# EAGLE design M783bad (EAGLE 6.6.0)
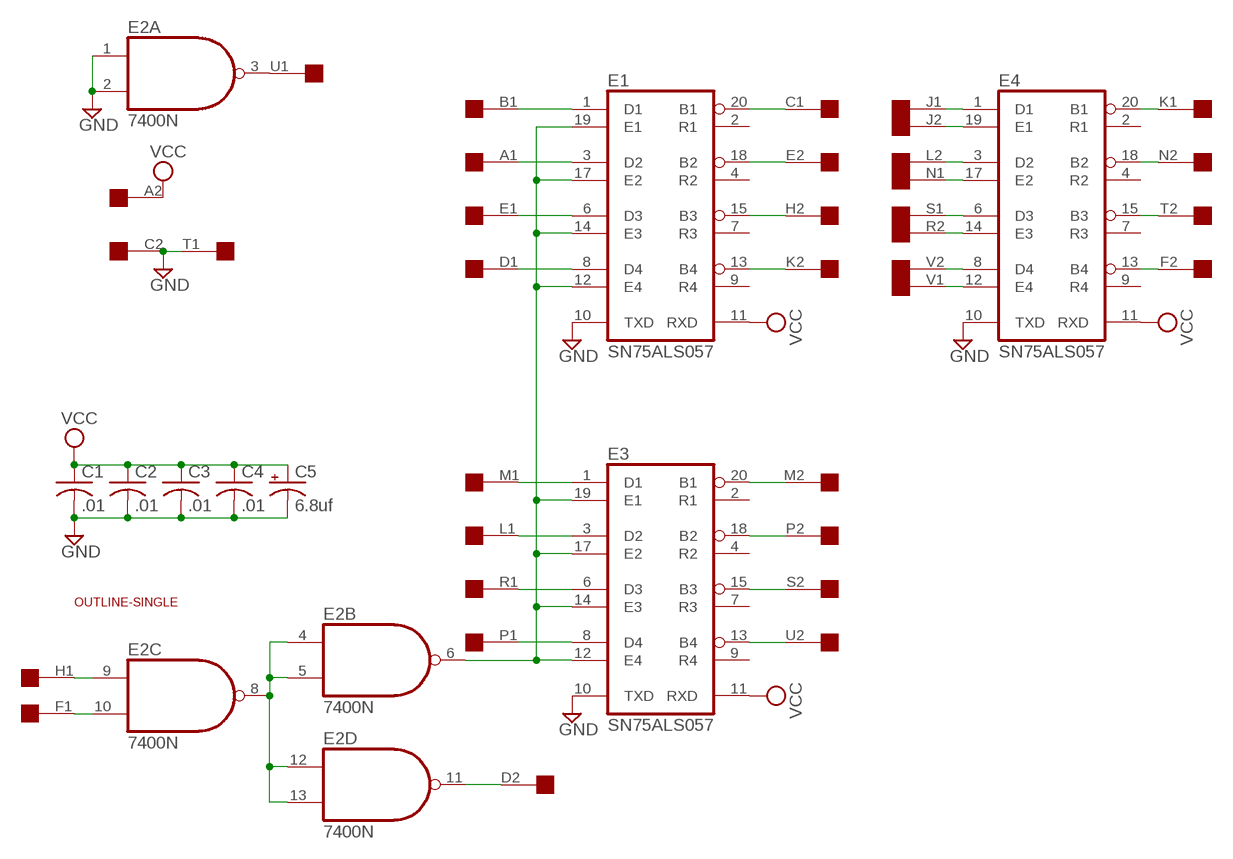
[diagram p0: schematic, sheet 1]

## Parts
C1  .01  C-US050-025X075  [C050-025X075]
C2  .01  C-US050-025X075  [C050-025X075]
C3  .01  C-US050-025X075  [C050-025X075]
C4  .01  C-US050-025X075  [C050-025X075]
C5  6.8uf  CPOL-USE15-5AXIAL  [E15-5]
E1  SN75ALS057  [DIL20]
E2  7400N  [DIL14]
E3  SN75ALS057  [DIL20]
E4  SN75ALS057  [DIL20]
U$1  SINGLE  [EDGE-CON2]
U$2  OUTLINE-SINGLE  [SINGLE]

## Nets
GND: C1.2 C2.2 C3.2 C4.2 C5.- E1.10(TXD) E2.1(A:I0) E2.2(A:I1) E3.10(TXD) E4.10(TXD) U$1.C2 U$1.T1
N$1: E2.3(A:O) U$1.U1
N$2: E1.12(E4) E1.14(E3) E1.17(E2) E1.19(E1) E2.6(B:O) E3.12(E4) E3.14(E3) E3.17(E2) E3.19(E1)
N$3: E3.20(B1) U$1.M2
N$4: E3.18(B2) U$1.P2
N$5: E3.8(D4) U$1.P1
N$6: E3.6(D3) U$1.R1
N$7: E3.15(B3) U$1.S2
N$8: E3.3(D2) U$1.L1
N$9: E3.13(B4) U$1.U2
N$10: E3.1(D1) U$1.M1
N$11: E1.20(B1) U$1.C1
N$12: E1.1(D1) U$1.B1
N$13: E1.18(B2) U$1.E2
N$14: E1.3(D2) U$1.A1
N$15: E1.15(B3) U$1.H2
N$16: E1.6(D3) U$1.E1
N$17: E1.13(B4) U$1.K2
N$18: E1.8(D4) U$1.D1
N$19: E2.11(D:O) U$1.D2
N$20: E4.13(B4) U$1.F2
N$21: E4.15(B3) U$1.T2
N$22: E4.18(B2) U$1.N2
N$23: E4.20(B1) U$1.K1
N$24: E4.1(D1) U$1.J1
N$25: E4.19(E1) U$1.J2
N$26: E4.3(D2) U$1.L2
N$27: E4.17(E2) U$1.N1
N$28: E4.6(D3) U$1.S1
N$29: E4.14(E3) U$1.R2
N$30: E2.4(B:I0) E2.5(B:I1) E2.8(C:O) E2.12(D:I0) E2.13(D:I1)
N$31: E2.9(C:I0) U$1.H1
N$32: E2.10(C:I1) U$1.F1
N$33: E4.8(D4) U$1.V2
N$34: E4.12(E4) U$1.V1
VCC: C1.1 C2.1 C3.1 C4.1 C5.+ E1.11(RXD) E3.11(RXD) E4.11(RXD) U$1.A2
Unconnected: E1.2(R1) E1.4(R2) E1.7(R3) E1.9(R4) E3.2(R1) E3.4(R2) E3.7(R3) E3.9(R4) E4.2(R1) E4.4(R2) E4.7(R3) E4.9(R4) U$1.B2

## Power pins joined to a net without a drawn wire
GND: E1.16(GND) E2.7(P:GND) E3.16(GND) E4.16(GND)
VCC: E1.5(VCC) E2.14(P:VCC) E3.5(VCC) E4.5(VCC)

## Library data of the parts
C1-C4 = rcl:C-US: CAPACITOR, American symbol
C5 = rcl:CPOL-US: POLARIZED CAPACITOR, American symbol
E1 E3 E4 = dec-con:SN75ALS057: Qbus-likeTransceiver
E2 = 74xx-us:74*00: Quad 2-input NAND gate
U$1 = dec-con:SINGLE: Single-Height DEC board
U$2 = dec-con:OUTLINE-*: Board outlines for DEC boards.

## Board
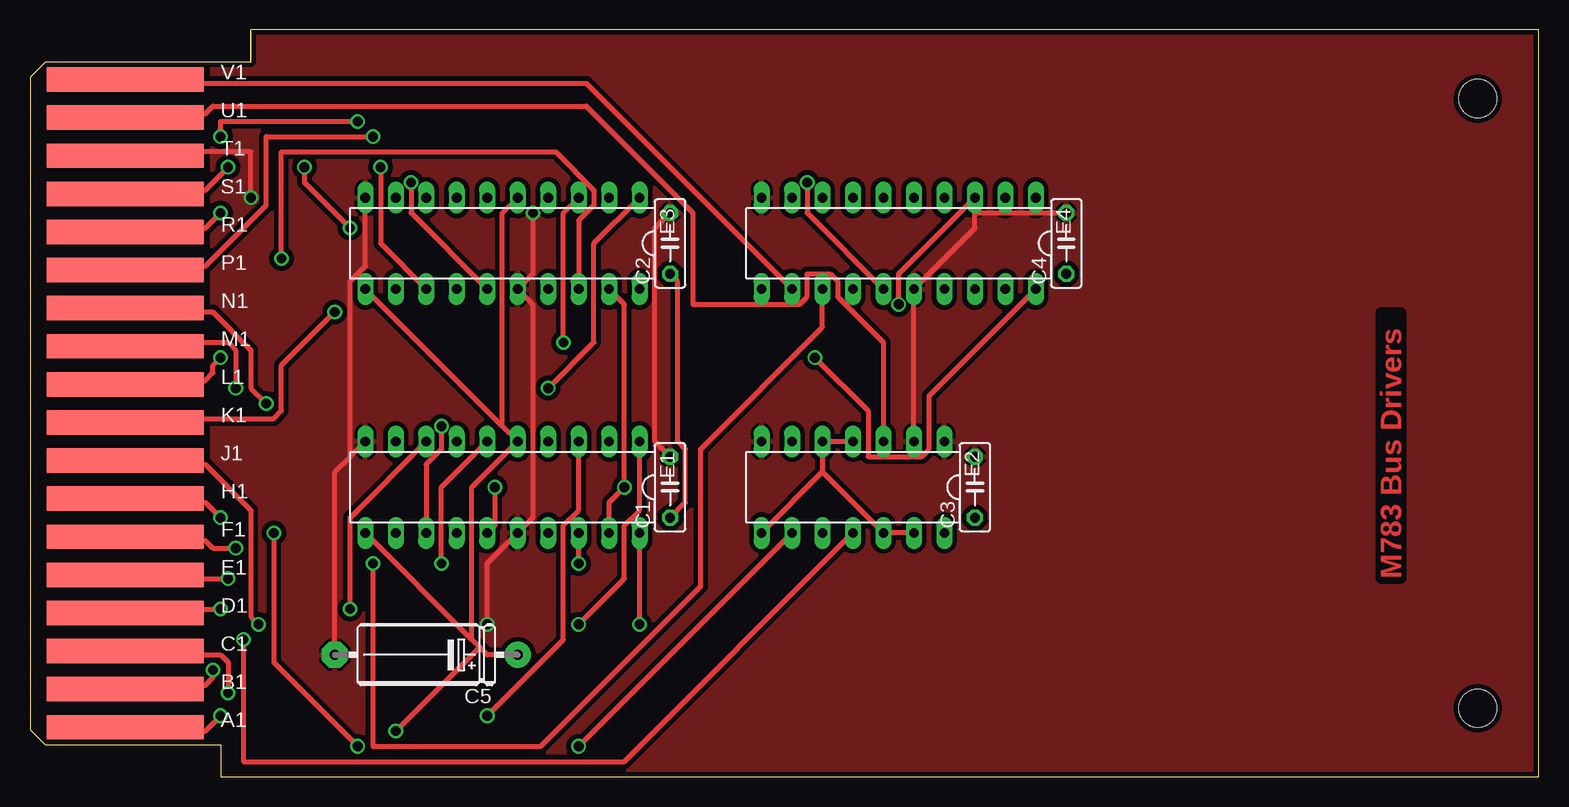
[diagram p1: board, top side]
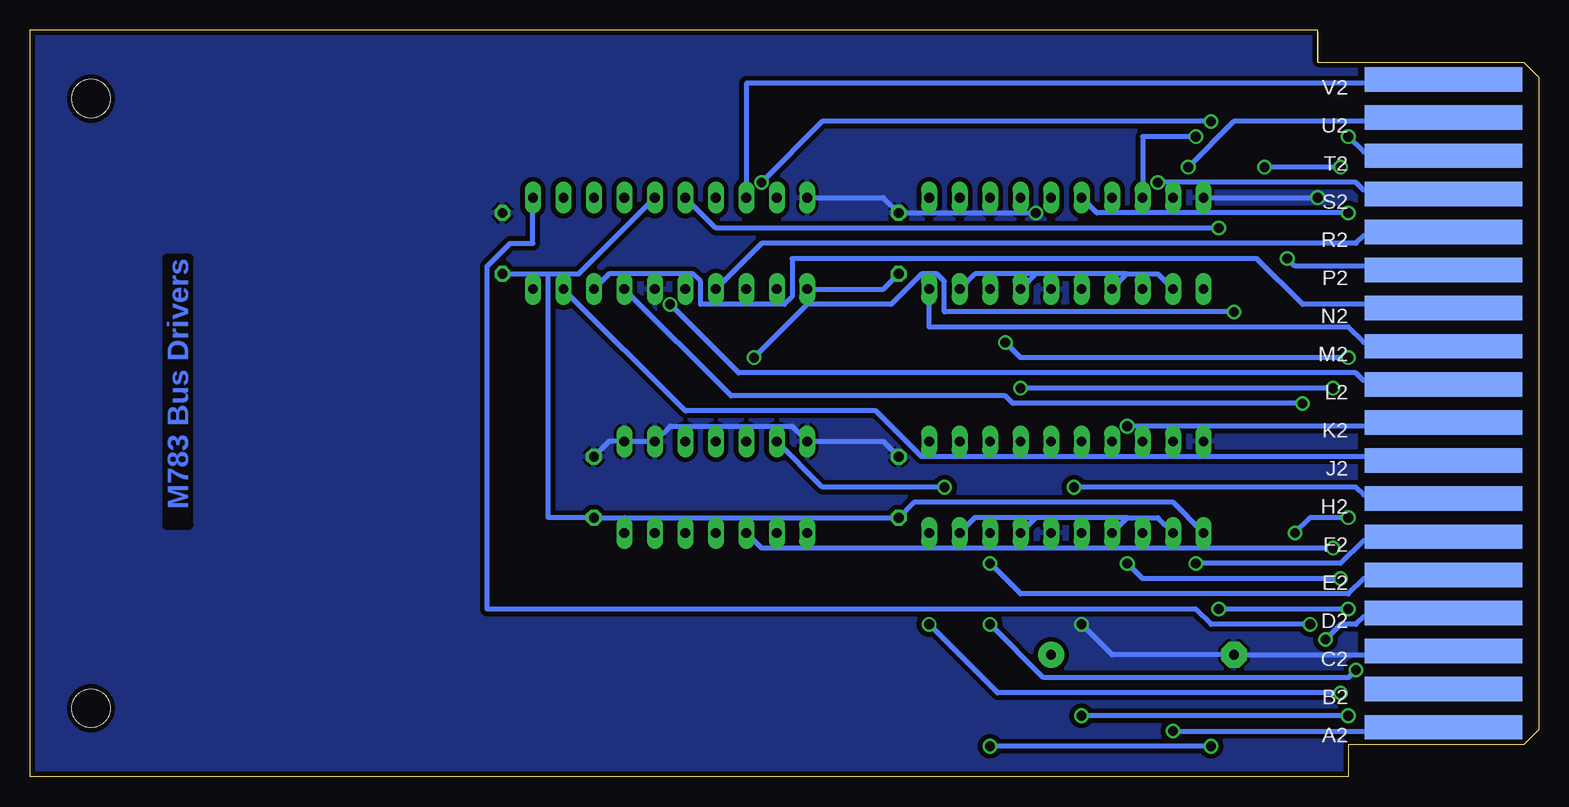
[diagram p2: board, bottom side, seen from below]

Size 125.73 x 62.23 mm. Coordinates in mm from the lower left corner, seen from the top.
Copper layers (1+16): Top 0.035mm / dielectric 1.5mm / Bottom 0.035mm
Design rules "16mils": minimum track width 16mil, minimum drill 32mil, track to track 15mil, track to pad 10mil, pad to pad 10mil, via to via 10mil, smd to smd 10mil, copper to edge 13mil, drill to drill 10mil, minimum pad ring 10mil, minimum via ring 8mil, stop-mask expansion 0mil, vias tented up to drill 0mil, thermal gap 10mil

### Footprints (pad centres in the part's own frame; a part is rotated, then mirrored left to right if it is on the bottom)
C050-025X075 = drill 0.813 octagon: 1 -2.54,0; 2 2.54,0
E15-5 = drill 0.813 pad 2.159: + -7.62,0 | drill 0.813 pad 2.159 octagon: - 7.62,0
DIL20 = drill 0.813 long: 1 -8.89,-3.81; 2 -6.35,-3.81; 3 -3.81,-3.81; 4 -1.27,-3.81; 5 1.27,-3.81; 6 3.81,-3.81; 7 6.35,-3.81; 8 8.89,-3.81; 9 11.43,-3.81; 10 13.97,-3.81; 11 13.97,3.81; 12 11.43,3.81; 13 8.89,3.81; 14 6.35,3.81; 15 3.81,3.81; 16 1.27,3.81; 17 -1.27,3.81; 18 -3.81,3.81; 19 -6.35,3.81; 20 -8.89,3.81
DIL14 = drill 0.813 long: 1 -7.62,-3.81; 2 -5.08,-3.81; 3 -2.54,-3.81; 4 0,-3.81; 5 2.54,-3.81; 6 5.08,-3.81; 7 7.62,-3.81; 8 7.62,3.81; 9 5.08,3.81; 10 2.54,3.81; 11 0,3.81; 12 -2.54,3.81; 13 -5.08,3.81; 14 -7.62,3.81
EDGE-CON2 = smd 13.106 x 2.032: A1 7.938,4.128; B1 7.938,7.303; C1 7.938,10.477; D1 7.938,13.652; E1 7.938,16.828; F1 7.938,20.003; H1 7.938,23.177; J1 7.938,26.352; K1 7.938,29.527; L1 7.938,32.703; M1 7.938,35.877; N1 7.938,39.053; P1 7.938,42.227; R1 7.938,45.403; S1 7.938,48.578; T1 7.938,51.752; U1 7.938,54.928; V1 7.938,58.102 | smd 13.106 x 2.032 bottom: A2 7.938,4.128; B2 7.938,7.303; C2 7.938,10.477; D2 7.938,13.652; E2 7.938,16.828; F2 7.938,20.003; H2 7.938,23.177; J2 7.938,26.352; K2 7.938,29.527; L2 7.938,32.703; M2 7.938,35.877; N2 7.938,39.053; P2 7.938,42.227; R2 7.938,45.403; S2 7.938,48.578; T2 7.938,51.752; U2 7.938,54.928; V2 7.938,58.102
SINGLE = hole 3.175: 120.65,56.515; 120.65,5.715

### Placement (x,y rotation side)
C1  53.34,24.13 90 top
C2  53.34,44.45 90 top
C3  78.74,24.13 90 top
C4  86.36,44.45 90 top
C5  33.02,10.16 180 top
E1  41.91,24.13 180 top
E2  68.58,24.13 180 top
E3  41.91,44.45 180 top
E4  74.93,44.45 180 top
U$1  0,0 0 top
U$2  0,0 0 top

### Tracks (layer width: path | path; a pad name or v marks a point on that pad's centre or on a via)
GND  (via drill 0.81)
  Top 0.406: E2.2 E4.16 78.74,45.72 78.74,46.99 C4.2 | C2.2 52.07,45.72 52.07,27.94 C1.2 | v41.91,46.99 41.91,41.91 E3.16 41.91,39.37 41.91,21.59 E1.16 38.1,17.78 v38.1,12.7 | 26.67,26.67 25.4,25.4 C5.- | 26.67,26.67 E1.10 | E3.10 27.94,42.55 26.67,41.27 26.67,26.67 | v18.42,48.26 18.42,52.07 8.26,52.07 U$1.T1
  Bottom 0.406: E4.10 54.61,48.26 C2.2 v41.91,46.99 | C1.2 54.61,27.94 E2.7 62.23,29.21 72.39,29.21 E2.2 E2.1 77.47,27.94 C3.2 | U$1.C2 8.26,10.16 C5.- 35.56,10.16 v38.1,12.7 | E3.10 v18.42,48.26
  pour Top (isolate 0.406): 15.24,62.23 125.73,62.23 125.73,0 15.24,0
  pour Bottom (isolate 0.406): 15.24,62.23 125.73,62.23 125.73,0 15.24,0
N$1
  Top 0.406: E2.3 71.12,36.2 67.31,40.01 67.31,41.27 66.68,41.91 64.77,41.91 64.77,40.01 64.14,39.37 55.25,39.37 55.25,46.99 46.36,55.88 15.24,55.88 14.61,55.24 8.26,55.24 U$1.U1
N$2  (via drill 0.81)
  Top 0.406: E1.19 48.26,22.86 v49.53,24.13 49.53,39.37 E3.19
  Bottom 0.406: E3.12 31.75,41.91 34.29,41.91 | E3.14 34.29,41.91 | 41.91,41.91 E3.17 | 34.29,41.91 41.91,41.91 | E3.19 46.99,41.91 41.91,41.91 | E1.12 31.75,21.59 34.29,21.59 | E1.14 34.29,21.59 | 41.91,21.59 E1.17 | 34.29,21.59 41.91,21.59 | E1.19 46.99,21.59 41.91,21.59 | E2.6 59.69,24.13 v49.53,24.13
N$3
  Bottom 0.406: E3.20 50.8,37.47 15.88,37.47 14.61,36.2 8.26,36.2 U$1.M2
N$4  (via drill 0.81)
  Top 0.406: E3.18 45.72,46.35 46.99,47.62 46.99,48.9 43.82,52.07 20.96,52.07 v20.96,43.18
  Bottom 0.406: v20.96,43.18 20.32,42.55 8.26,42.55 U$1.P2
N$5  (via drill 0.81)
  Top 0.406: v28.58,53.34 19.69,53.34 19.69,47.62 14.61,42.55 8.26,42.55 U$1.P1
  Bottom 0.406: E3.8 33.02,53.34 v28.58,53.34
N$6  (via drill 0.81)
  Top 0.406: v15.88,46.99 14.61,45.72 8.26,45.72 U$1.R1
  Bottom 0.406: E3.6 36.83,46.99 v15.88,46.99
N$7  (via drill 0.81)
  Top 0.406: E3.15 31.75,46.99 v31.75,49.53
  Bottom 0.406: v31.75,49.53 15.24,49.53 14.61,48.9 8.26,48.9 U$1.S2
N$8  (via drill 0.81)
  Top 0.406: E3.3 44.45,46.99 v44.45,36.2 | v15.88,34.92 15.24,34.29 15.24,33.66 14.61,33.02 8.26,33.02 U$1.L1
  Bottom 0.406: v44.45,36.2 43.18,34.92 v15.88,34.92
N$9  (via drill 0.81)
  Top 0.406: E3.13 29.21,44.45 v29.21,50.8
  Bottom 0.406: v29.21,50.8 25.4,54.61 8.26,54.61 U$1.U2
N$10  (via drill 0.81)
  Top 0.406: E3.1 46.99,44.45 46.99,36.2 v43.18,32.38 | v17.15,32.38 17.15,35.56 16.51,36.2 8.26,36.2 U$1.M1
  Bottom 0.406: v17.15,32.38 v43.18,32.38
N$11  (via drill 0.81)
  Top 0.406: v50.8,12.7 E1.20 | v16.51,6.99 16.51,9.53 15.88,10.16 8.26,10.16 U$1.C1
  Bottom 0.406: v50.8,12.7 45.09,6.99 v16.51,6.99
N$12  (via drill 0.81)
  Top 0.406: E1.1 50.8,22.23 49.53,20.95 49.53,16.51 v45.72,12.7 | v15.24,8.89 15.24,8.26 14.61,7.62 8.26,7.62 U$1.B1
  Bottom 0.406: v45.72,12.7 41.28,8.26 15.88,8.26 v15.24,8.89
N$13  (via drill 0.81)
  Top 0.406: v45.72,17.78 E1.18
  Bottom 0.406: v45.72,17.78 43.18,15.24 15.88,15.24 14.61,16.51 8.26,16.51 U$1.E2
N$14  (via drill 0.81)
  Top 0.406: E1.3 45.72,22.23 44.45,20.95 44.45,11.43 v38.1,5.08 | v15.88,5.08 14.61,3.81 8.26,3.81 U$1.A1
  Bottom 0.406: v15.88,5.08 v38.1,5.08
N$15  (via drill 0.81)
  Top 0.406: E1.15 38.74,20.95 v38.74,24.13
  Bottom 0.406: v38.74,24.13 15.24,24.13 14.61,23.5 8.26,23.5 U$1.H2
N$16  (via drill 0.81)
  Top 0.406: E1.6 34.29,24.13 v34.29,17.78 | v16.51,16.51 8.26,16.51 U$1.E1
  Bottom 0.406: v34.29,17.78 33.02,16.51 v16.51,16.51
N$17  (via drill 0.81)
  Top 0.406: E1.13 33.02,26.04 34.29,27.3 v34.29,29.21
  Bottom 0.406: v34.29,29.21 8.26,29.21 U$1.K2
N$18  (via drill 0.81)
  Top 0.406: E1.8 26.67,21.59 v26.67,13.97 | v15.88,13.97 8.26,13.97 U$1.D1
  Bottom 0.406: v15.88,13.97 v26.67,13.97
N$19  (via drill 0.81)
  Top 0.406: E2.11 49.53,1.27 17.78,1.27 v17.78,11.43
  Bottom 0.406: v17.78,11.43 16.51,12.7 15.24,12.7 14.61,13.34 8.26,13.34 U$1.D2
N$20  (via drill 0.81)
  Top 0.406: E4.13 66.04,37.47 55.88,27.3 55.88,15.88 42.55,2.54 28.58,2.54 v28.58,17.78
  Bottom 0.406: v28.58,17.78 16.51,17.78 14.61,19.68 8.26,19.68 U$1.F2
N$21  (via drill 0.81)
  Top 0.406: E4.15 64.77,46.99 v64.77,49.53 | v27.31,54.61 15.88,54.61 v15.88,53.34
  Bottom 0.406: v64.77,49.53 59.69,54.61 v27.31,54.61 | v15.88,53.34 14.61,52.07 8.26,52.07 U$1.T2
N$22
  Bottom 0.406: E4.18 77.47,41.91 70.49,41.91 69.85,41.27 69.85,39.37 62.87,39.37 62.23,40.01 62.23,43.18 23.5,43.18 19.69,39.37 8.26,39.37 U$1.N2
N$23  (via drill 0.81)
  Top 0.406: E4.20 74.93,31.75 74.93,27.3 74.3,26.67 69.85,26.67 69.85,30.48 v65.41,34.92 | v25.4,38.73 20.96,34.29 20.96,30.48 20.32,29.84 8.26,29.84 U$1.K1
  Bottom 0.406: v65.41,34.92 60.96,39.37 53.98,39.37 51.44,41.91 50.17,41.91 49.53,41.27 49.53,38.73 v25.4,38.73
N$24  (via drill 0.81)
  Top 0.406: v19.05,12.7 18.42,13.34 18.42,22.23 14.61,26.04 8.26,26.04 U$1.J1
  Bottom 0.406: E4.1 83.82,44.45 85.73,44.45 87.63,42.55 87.63,13.97 28.58,13.97 27.31,12.7 v19.05,12.7
N$25
  Bottom 0.406: E4.19 71.12,30.48 55.25,30.48 51.44,26.67 8.26,26.67 U$1.J2
N$26  (via drill 0.81)
  Top 0.406: E4.3 72.39,41.91 v72.39,39.37
  Bottom 0.406: v72.39,39.37 66.68,33.66 15.24,33.66 14.61,33.02 8.26,33.02 U$1.L2
N$27  (via drill 0.81)
  Top 0.406: v19.69,31.11 18.42,32.38 18.42,35.56 15.24,38.73 8.26,38.73 U$1.N1
  Bottom 0.406: E4.17 67.31,31.75 44.45,31.75 43.82,31.11 v19.69,31.11
N$28  (via drill 0.81)
  Top 0.406: v26.67,45.72 22.86,49.53 v22.86,50.8 | v16.51,50.8 14.61,48.9 8.26,48.9 U$1.S1
  Bottom 0.406: E4.6 68.58,45.72 v26.67,45.72 | v16.51,50.8 v22.86,50.8
N$29
  Bottom 0.406: E4.14 64.77,44.45 15.24,44.45 14.61,45.09 8.26,45.09 U$1.R2
N$30
  Top 0.406: E2.13 E2.12 66.04,25.4 | 66.04,25.4 E2.8 | 66.04,25.4 E2.5 E2.4
N$31  (via drill 0.81)
  Top 0.406: v45.72,2.54 E2.9 | v27.31,2.54 20.32,9.53 v20.32,20.32 | v15.88,21.59 14.61,22.86 8.26,22.86 U$1.H1
  Bottom 0.406: v27.31,2.54 v45.72,2.54 | v20.32,20.32 19.05,21.59 v15.88,21.59
N$32  (via drill 0.81)
  Top 0.406: v17.15,19.05 15.24,19.05 14.61,19.68 8.26,19.68 U$1.F1
  Bottom 0.406: E2.10 64.77,19.05 v17.15,19.05
N$33
  Bottom 0.406: E4.8 66.04,57.78 8.26,57.78 U$1.V2
N$34
  Top 0.406: E4.12 46.36,57.78 8.26,57.78 U$1.V1
VCC  (via drill 0.81)
  Top 0.406: C2.1 53.98,41.27 53.98,27.94 54.61,27.3 54.61,22.86 C1.1 | 37.47,10.79 38.1,10.16 C5.+ | 37.47,10.79 36.83,11.43 | 36.83,11.43 E1.11 | 36.83,11.43 36.83,24.13 E1.5 39.37,29.21 | 39.37,29.21 E3.11 | E3.5 39.37,46.99 39.37,29.21 | 37.47,10.79 v30.48,3.81
  Bottom 0.406: E4.5 80.01,41.91 82.55,41.91 | C4.1 82.55,41.91 | C2.1 54.61,40.64 E4.11 | 76.2,21.59 C3.1 82.55,21.59 82.55,41.91 | 76.2,21.59 C1.1 52.07,22.86 30.48,22.86 E1.11 | 76.2,21.59 E2.14 | v30.48,3.81 8.26,3.81 U$1.A2

### Text on the board
Top: M783 Bus Drivers
Bottom: M783 Bus Drivers